# Altium schematic sheet 1、DXP原理图.SchDoc
size A4; SheetNumber: 0; SheetTotal: 0
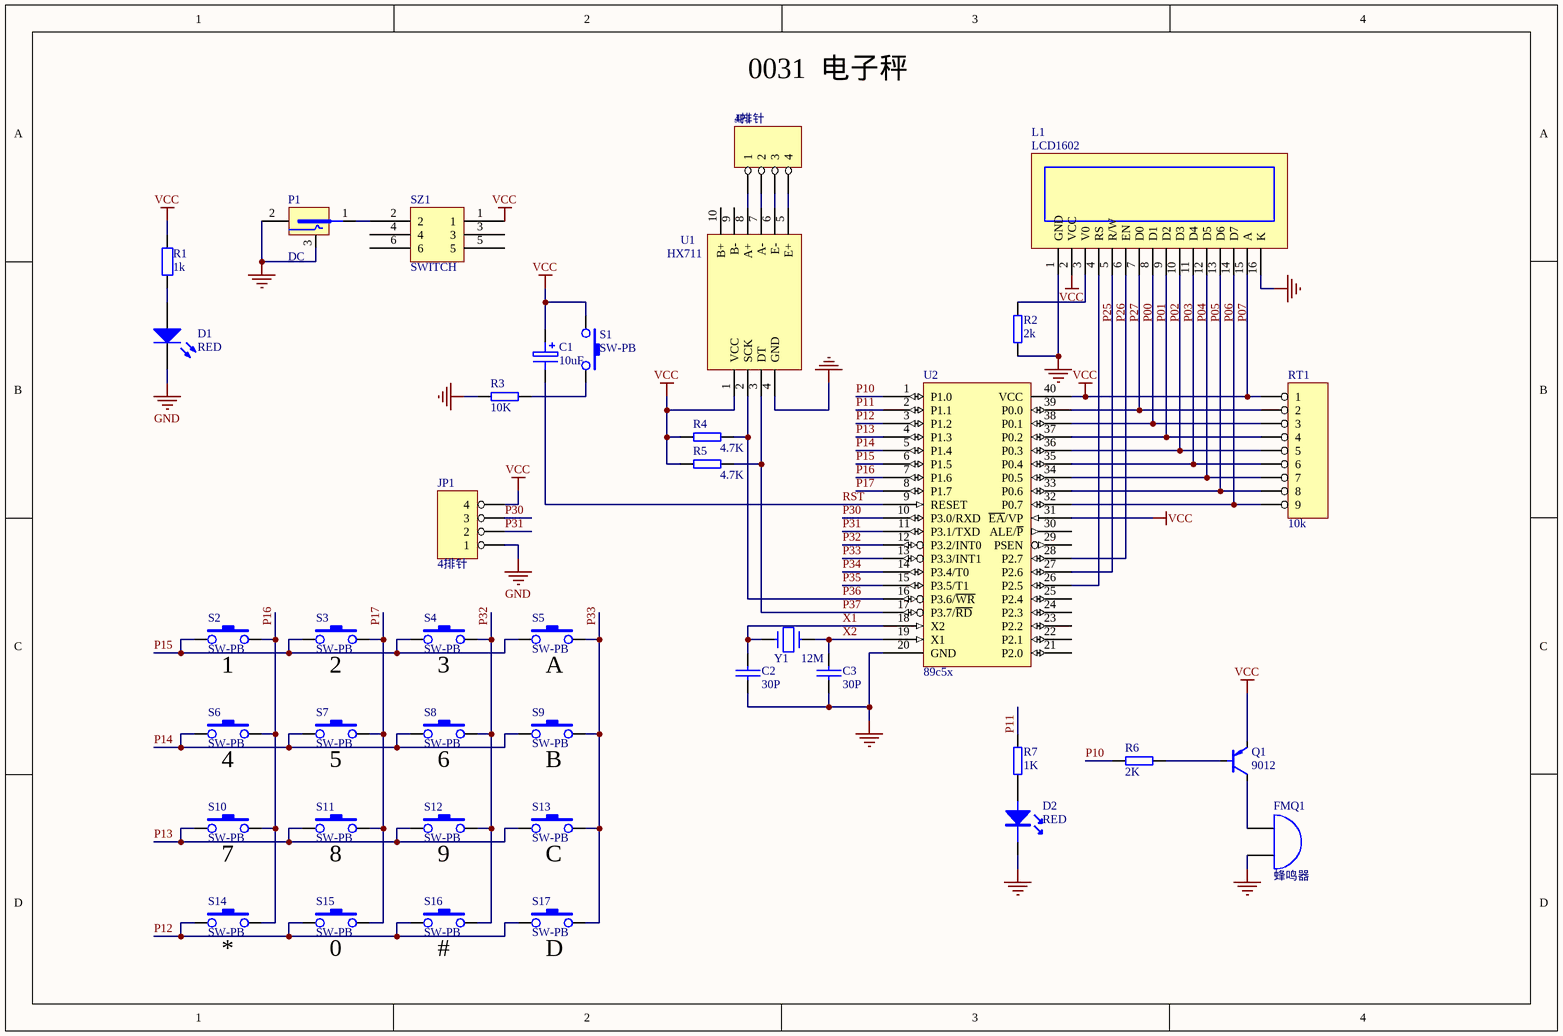
[diagram p0: 1、DXP原理图.SchDoc]

## Parts
(Parts that share a designator on the sheet are numbered #1, #2 ... from top to bottom, then left to right.)
C1  10uF  [25V/4.7U]
C2  30P  [CAP-2.54]
C3  30P  [CAP-2.54]
D1  RED  [LED-3mm]
D2  RED  [LED5MM-RED]
FMQ1  蜂鸣器  [BELL]
JP1#1  4排针  [SIPA04]
JP1#2  4排针  [SIPA04]
L1  LCD1602  [LCD1602]
P1  DC  [DC002]
Q1  9012  [NPN]
R1  1k  [AXIAL-0.4]
R2  2k  [AXIAL-0.4]
R3  10K  [AXIAL-0.4]
R4  4.7K  [AXIAL-0.4]
R5  4.7K  [AXIAL-0.4]
R6  2K  [AXIAL-0.4]
R7  1K  [AXIAL-0.4]
RT1  10k  [SIP9]
S1  SW-PB  [SW-PB]
S2  SW-PB  [SW-PB]
S3  SW-PB  [SW-PB]
S4  SW-PB  [SW-PB]
S5  SW-PB  [SW-PB]
S6  SW-PB  [SW-PB]
S7  SW-PB  [SW-PB]
S8  SW-PB  [SW-PB]
S9  SW-PB  [SW-PB]
S10  SW-PB  [SW-PB]
S11  SW-PB  [SW-PB]
S12  SW-PB  [SW-PB]
S13  SW-PB  [SW-PB]
S14  SW-PB  [SW-PB]
S15  SW-PB  [SW-PB]
S16  SW-PB  [SW-PB]
S17  SW-PB  [SW-PB]
SZ1  SWITCH  [SW7x7]
U1  HX711  [HX711]
U2  89c5x  [DIP40]
Y1  12M  [XTAL]

## Nets
GND: C2.2 C3.2 D1.2(K) D2.2 FMQ1.2(B) JP1#2.1 L1.1(GND) L1.16(K) P1.2 P1.3 R2.2 R3.1 U1.4(GND) U2.20(GND)
VCC: C1.1 JP1#2.4 L1.2(VCC) L1.15(A) Q1.2(e) R1.2 R4.1 R5.1 RT1.1 S1.1 SZ1.1 U1.1(VCC) U2.31(~{EA}/VP) U2.40(VCC)
P00: L1.7(D0) RT1.2 U2.39(P0.0)
P01: L1.8(D1) RT1.3 U2.38(P0.1)
P02: L1.9(D2) RT1.4 U2.37(P0.2)
P03: L1.10(D3) RT1.5 U2.36(P0.3)
P04: L1.11(D4) RT1.6 U2.35(P0.4)
P05: L1.12(D5) RT1.7 U2.34(P0.5)
P06: L1.13(D6) RT1.8 U2.33(P0.6)
P07: L1.14(D7) RT1.9 U2.32(P0.7)
P10: R6.2 U2.1(P1.0)
P11: R7.1 U2.2(P1.1)
P12: S14.1 S15.1 S16.1 S17.1 U2.3(P1.2)
P13: S10.1 S11.1 S12.1 S13.1 U2.4(P1.3)
P14: S6.1 S7.1 S8.1 S9.1 U2.5(P1.4)
P15: S2.1 S3.1 S4.1 S5.1 U2.6(P1.5)
P16: S2.2 S6.2 S10.2 S14.2 U2.7(P1.6)
P17: S3.2 S7.2 S11.2 S15.2 U2.8(P1.7)
P25: L1.4(RS) U2.26(P2.5)
P26: L1.5(R/W) U2.27(P2.6)
P27: L1.6(EN) U2.28(P2.7)
P30: JP1#2.3 U2.10(P3.0/RXD)
P31: JP1#2.2 U2.11(P3.1/TXD)
P32: S4.2 S8.2 S12.2 S16.2 U2.12(P3.2/INT0)
P33: S5.2 S9.2 S13.2 S17.2 U2.13(P3.3/INT1)
P34: U2.14(P3.4/T0)
P35: U2.15(P3.5/T1)
P36: R4.2 U1.2(SCK) U2.16(P3.6/~{WR})
P37: R5.2 U1.3(DT) U2.17(P3.7/~{RD})
RST: C1.2 U2.9(RESET)
X1: C2.1 U2.18(X2) Y1.1
X2: C3.1 U2.19(X1) Y1.2
NetD1_1: D1.1(A) R1.1
NetD2_1: D2.1 R7.2
NetFMQ1_1: FMQ1.1(A) Q1.3(C)
NetJP1#1_1: JP1#1.1 U1.8(A+)
NetJP1#1_2: JP1#1.2 U1.7(A-)
NetJP1#1_3: JP1#1.3 U1.6(E-)
NetJP1#1_4: JP1#1.4 U1.5(E+)
NetL1_3: L1.3(V0) R2.1
NetP1_1: P1.1 SZ1.2
NetQ1_1: Q1.1(b) R6.1
NetR3_2: R3.2 S1.2

Not connected (* = marked no-connect by the designer): SZ1 3 4 5 6; U1 9(B-) 10(B+); U2 21(P2.0) 22(P2.1) 23(P2.2) 24(P2.3) 25(P2.4) 29(PSEN) 30(ALE/~{P})

## Notes on the sheet
- (near S2) 1
- (near S3) 2
- (near S4) 3
- (near S5) A
- (near S6) 4
- (near S7) 5
- (near S8) 6
- (near S9) B
- (near S10) 7
- (near S11) 8
- (near S12) 9
- (near S13) C
- (near S14) *
- (near S15) 0
- (near S16) #
- (near S17) D
- Labels drawn without touching a wire or pin: 0031  电子秤

## Library data of the parts
C1 = ELECTRO1: 电容
C2 C3 = CAP: 电容
D1 = LED2: 3MM　红色发光二极管; Published: 8-Jun-2000; LatestRevisionDate: 17-Jul-2002; LatestRevisionNote: Re-released for DXP Platform.; PackageDocument: Feb-2002; PackageReference: 3.2X1.6X1.1; Publisher: Altium Limited
D2 = LED: 5MM  红色发光二极管
FMQ1 = BELL
JP1#1 JP1#2 = 4 HEADER: 压力传感器接口
L1 = LCM1602: 液晶显示屏
P1 = POWER: DC电源座子
Q1 = PNP: PNP三极管
R1 = Res2: 电阻; Published: 8-Jun-2000; LatestRevisionDate: 17-Jul-2002; LatestRevisionNote: Re-released for DXP Platform.; PackageReference: AXIAL-0.4; Publisher: Altium Limited; Value: 1K
R2-R7 = RES2: 电阻
RT1 = HEADER 9: 排阻
S1-S17 = SW-PB: 微动开关
SZ1 = SWITCH: 电源开关
U1 = HX711: AD模块
U2 = AT89C51: 51单片机
Y1 = CRYSTAL: 晶振